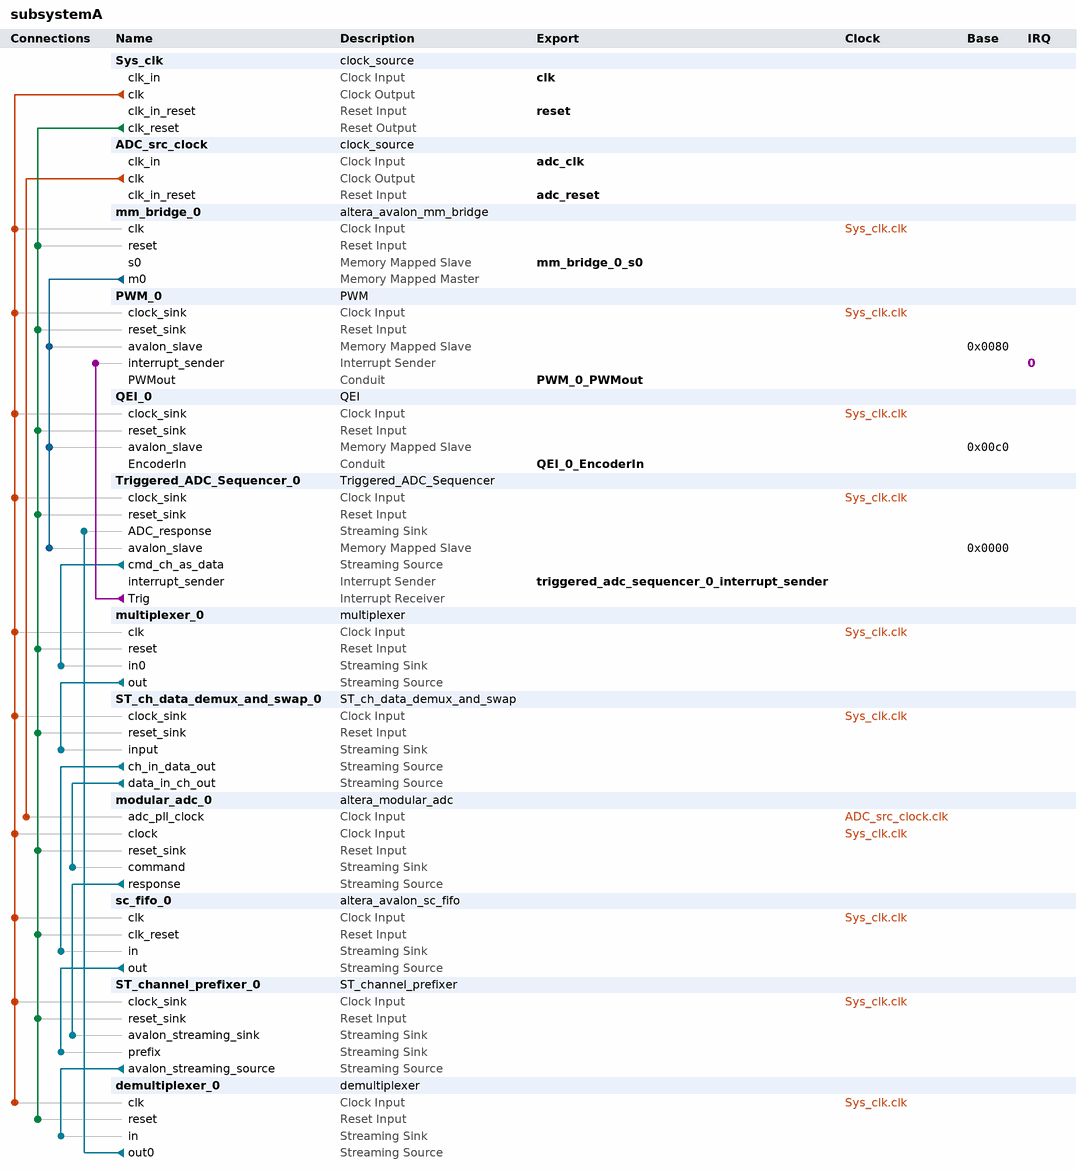
[diagram p0: system contents]
# Platform Designer (Qsys) system subsystemA, MAX 10 10M08SAE144C8GES
# Parameters at their usual value, and those the tool derives, are not listed.
package require -exact qsys 14.1
create_system subsystemA
set_project_property DEVICE_FAMILY {MAX 10}
set_project_property DEVICE 10M08SAE144C8GES

add_instance Sys_clk clock_source 14.1
set_instance_parameter_value Sys_clk clockFrequency 50000000
set_instance_parameter_value Sys_clk clockFrequencyKnown false

add_instance ADC_src_clock clock_source 14.1
set_instance_parameter_value ADC_src_clock clockFrequency 50000000
set_instance_parameter_value ADC_src_clock clockFrequencyKnown false

add_instance mm_bridge_0 altera_avalon_mm_bridge 14.1
set_instance_parameter_value mm_bridge_0 ADDRESS_UNITS SYMBOLS
set_instance_parameter_value mm_bridge_0 ADDRESS_WIDTH 10
set_instance_parameter_value mm_bridge_0 DATA_WIDTH 32
set_instance_parameter_value mm_bridge_0 MAX_PENDING_RESPONSES 4
set_instance_parameter_value mm_bridge_0 PIPELINE_COMMAND 0
set_instance_parameter_value mm_bridge_0 PIPELINE_RESPONSE 0
set_instance_parameter_value mm_bridge_0 USE_AUTO_ADDRESS_WIDTH 1

add_instance PWM_0 PWM 1.0

add_instance QEI_0 QEI 1.0

add_instance Triggered_ADC_Sequencer_0 Triggered_ADC_Sequencer 1.0

add_instance multiplexer_0 multiplexer 14.1
set_instance_parameter_value multiplexer_0 bitsPerSymbol 5
set_instance_parameter_value multiplexer_0 errorWidth 0
set_instance_parameter_value multiplexer_0 numInputInterfaces 3
set_instance_parameter_value multiplexer_0 outChannelWidth 2
set_instance_parameter_value multiplexer_0 packetScheduling true
set_instance_parameter_value multiplexer_0 schedulingSize 2
set_instance_parameter_value multiplexer_0 symbolsPerBeat 1
set_instance_parameter_value multiplexer_0 useHighBitsOfChannel true
set_instance_parameter_value multiplexer_0 usePackets true

add_instance ST_ch_data_demux_and_swap_0 ST_ch_data_demux_and_swap 1.0

add_instance modular_adc_0 altera_modular_adc 14.1
set_instance_parameter_value modular_adc_0 CLOCK_FREQ 0
set_instance_parameter_value modular_adc_0 CORE_VAR 3
set_instance_parameter_value modular_adc_0 DEVICE_PART 10M08SAE144C8GES
set_instance_parameter_value modular_adc_0 clkdiv 2
set_instance_parameter_value modular_adc_0 external_vref 3.3
set_instance_parameter_value modular_adc_0 int_vref_vr 3.3
set_instance_parameter_value modular_adc_0 refsel 0
set_instance_parameter_value modular_adc_0 seq_order_length 1
set_instance_parameter_value modular_adc_0 seq_order_slot_1 0
set_instance_parameter_value modular_adc_0 seq_order_slot_2 30
set_instance_parameter_value modular_adc_0 seq_order_slot_3 30
set_instance_parameter_value modular_adc_0 seq_order_slot_4 30
set_instance_parameter_value modular_adc_0 seq_order_slot_5 30
set_instance_parameter_value modular_adc_0 seq_order_slot_6 30
set_instance_parameter_value modular_adc_0 seq_order_slot_7 30
set_instance_parameter_value modular_adc_0 tsclkdiv 1
set_instance_parameter_value modular_adc_0 use_ch0 true
set_instance_parameter_value modular_adc_0 use_ch2 true
set_instance_parameter_value modular_adc_0 use_ch3 true
set_instance_parameter_value modular_adc_0 use_ch4 true
set_instance_parameter_value modular_adc_0 use_ch5 true
set_instance_parameter_value modular_adc_0 use_ch6 true
set_instance_parameter_value modular_adc_0 use_ch7 true
set_instance_parameter_value modular_adc_0 use_ch8 true
set_instance_parameter_value modular_adc_0 use_tsd true

add_instance sc_fifo_0 altera_avalon_sc_fifo 14.1
set_instance_parameter_value sc_fifo_0 BITS_PER_SYMBOL 2
set_instance_parameter_value sc_fifo_0 CHANNEL_WIDTH 0
set_instance_parameter_value sc_fifo_0 ERROR_WIDTH 0
set_instance_parameter_value sc_fifo_0 FIFO_DEPTH 2
set_instance_parameter_value sc_fifo_0 USE_FILL_LEVEL 0
set_instance_parameter_value sc_fifo_0 USE_MEMORY_BLOCKS 1
set_instance_parameter_value sc_fifo_0 USE_STORE_FORWARD 0

add_instance ST_channel_prefixer_0 ST_channel_prefixer 1.0

add_instance demultiplexer_0 demultiplexer 14.1
set_instance_parameter_value demultiplexer_0 bitsPerSymbol 12
set_instance_parameter_value demultiplexer_0 errorWidth 0
set_instance_parameter_value demultiplexer_0 inChannelWidth 7
set_instance_parameter_value demultiplexer_0 numOutputInterfaces 3
set_instance_parameter_value demultiplexer_0 symbolsPerBeat 1
set_instance_parameter_value demultiplexer_0 useHighBitsOfChannel true
set_instance_parameter_value demultiplexer_0 usePackets true

# connections
add_connection ADC_src_clock.clk modular_adc_0.adc_pll_clock clock
add_connection Sys_clk.clk demultiplexer_0.clk clock
add_connection Sys_clk.clk mm_bridge_0.clk clock
add_connection Sys_clk.clk modular_adc_0.clock clock
add_connection Sys_clk.clk multiplexer_0.clk clock
add_connection Sys_clk.clk PWM_0.clock_sink clock
add_connection Sys_clk.clk QEI_0.clock_sink clock
add_connection Sys_clk.clk sc_fifo_0.clk clock
add_connection Sys_clk.clk ST_ch_data_demux_and_swap_0.clock_sink clock
add_connection Sys_clk.clk ST_channel_prefixer_0.clock_sink clock
add_connection Sys_clk.clk Triggered_ADC_Sequencer_0.clock_sink clock
add_connection Sys_clk.clk_reset demultiplexer_0.reset reset
add_connection Sys_clk.clk_reset mm_bridge_0.reset reset
add_connection Sys_clk.clk_reset modular_adc_0.reset_sink reset
add_connection Sys_clk.clk_reset multiplexer_0.reset reset
add_connection Sys_clk.clk_reset PWM_0.reset_sink reset
add_connection Sys_clk.clk_reset QEI_0.reset_sink reset
add_connection Sys_clk.clk_reset sc_fifo_0.clk_reset reset
add_connection Sys_clk.clk_reset ST_ch_data_demux_and_swap_0.reset_sink reset
add_connection Sys_clk.clk_reset ST_channel_prefixer_0.reset_sink reset
add_connection Sys_clk.clk_reset Triggered_ADC_Sequencer_0.reset_sink reset
add_connection mm_bridge_0.m0 PWM_0.avalon_slave avalon
set_connection_parameter_value mm_bridge_0.m0/PWM_0.avalon_slave baseAddress 0x0080
add_connection mm_bridge_0.m0 QEI_0.avalon_slave avalon
set_connection_parameter_value mm_bridge_0.m0/QEI_0.avalon_slave baseAddress 0x00c0
add_connection mm_bridge_0.m0 Triggered_ADC_Sequencer_0.avalon_slave avalon
set_connection_parameter_value mm_bridge_0.m0/Triggered_ADC_Sequencer_0.avalon_slave baseAddress 0x0000
add_connection demultiplexer_0.out0 Triggered_ADC_Sequencer_0.ADC_response avalon_streaming
add_connection modular_adc_0.response ST_channel_prefixer_0.avalon_streaming_sink avalon_streaming
add_connection multiplexer_0.out ST_ch_data_demux_and_swap_0.input avalon_streaming
add_connection sc_fifo_0.out ST_channel_prefixer_0.prefix avalon_streaming
add_connection ST_ch_data_demux_and_swap_0.ch_in_data_out sc_fifo_0.in avalon_streaming
add_connection ST_ch_data_demux_and_swap_0.data_in_ch_out modular_adc_0.command avalon_streaming
add_connection ST_channel_prefixer_0.avalon_streaming_source demultiplexer_0.in avalon_streaming
add_connection Triggered_ADC_Sequencer_0.cmd_ch_as_data multiplexer_0.in0 avalon_streaming
add_connection Triggered_ADC_Sequencer_0.Trig PWM_0.interrupt_sender interrupt
set_connection_parameter_value Triggered_ADC_Sequencer_0.Trig/PWM_0.interrupt_sender irqNumber 0

# exported interfaces
add_interface PWM_0_PWMout conduit end
set_interface_property PWM_0_PWMout EXPORT_OF PWM_0.PWMout
add_interface QEI_0_EncoderIn conduit end
set_interface_property QEI_0_EncoderIn EXPORT_OF QEI_0.EncoderIn
add_interface adc_clk clock sink
set_interface_property adc_clk EXPORT_OF ADC_src_clock.clk_in
add_interface adc_reset reset sink
set_interface_property adc_reset EXPORT_OF ADC_src_clock.clk_in_reset
add_interface clk clock sink
set_interface_property clk EXPORT_OF Sys_clk.clk_in
add_interface mm_bridge_0_s0 avalon slave
set_interface_property mm_bridge_0_s0 EXPORT_OF mm_bridge_0.s0
add_interface reset reset sink
set_interface_property reset EXPORT_OF Sys_clk.clk_in_reset
add_interface triggered_adc_sequencer_0_interrupt_sender interrupt sender
set_interface_property triggered_adc_sequencer_0_interrupt_sender EXPORT_OF Triggered_ADC_Sequencer_0.interrupt_sender

set_interconnect_requirement {$system} qsys_mm.clockCrossingAdapter HANDSHAKE
set_interconnect_requirement {$system} qsys_mm.insertDefaultSlave FALSE
set_interconnect_requirement {$system} qsys_mm.maxAdditionalLatency 1

save_system subsystemA.qsys
